# EAGLE design RF1_RS485v5 (EAGLE 6.4)
RS485/Renard adapter for the RF1
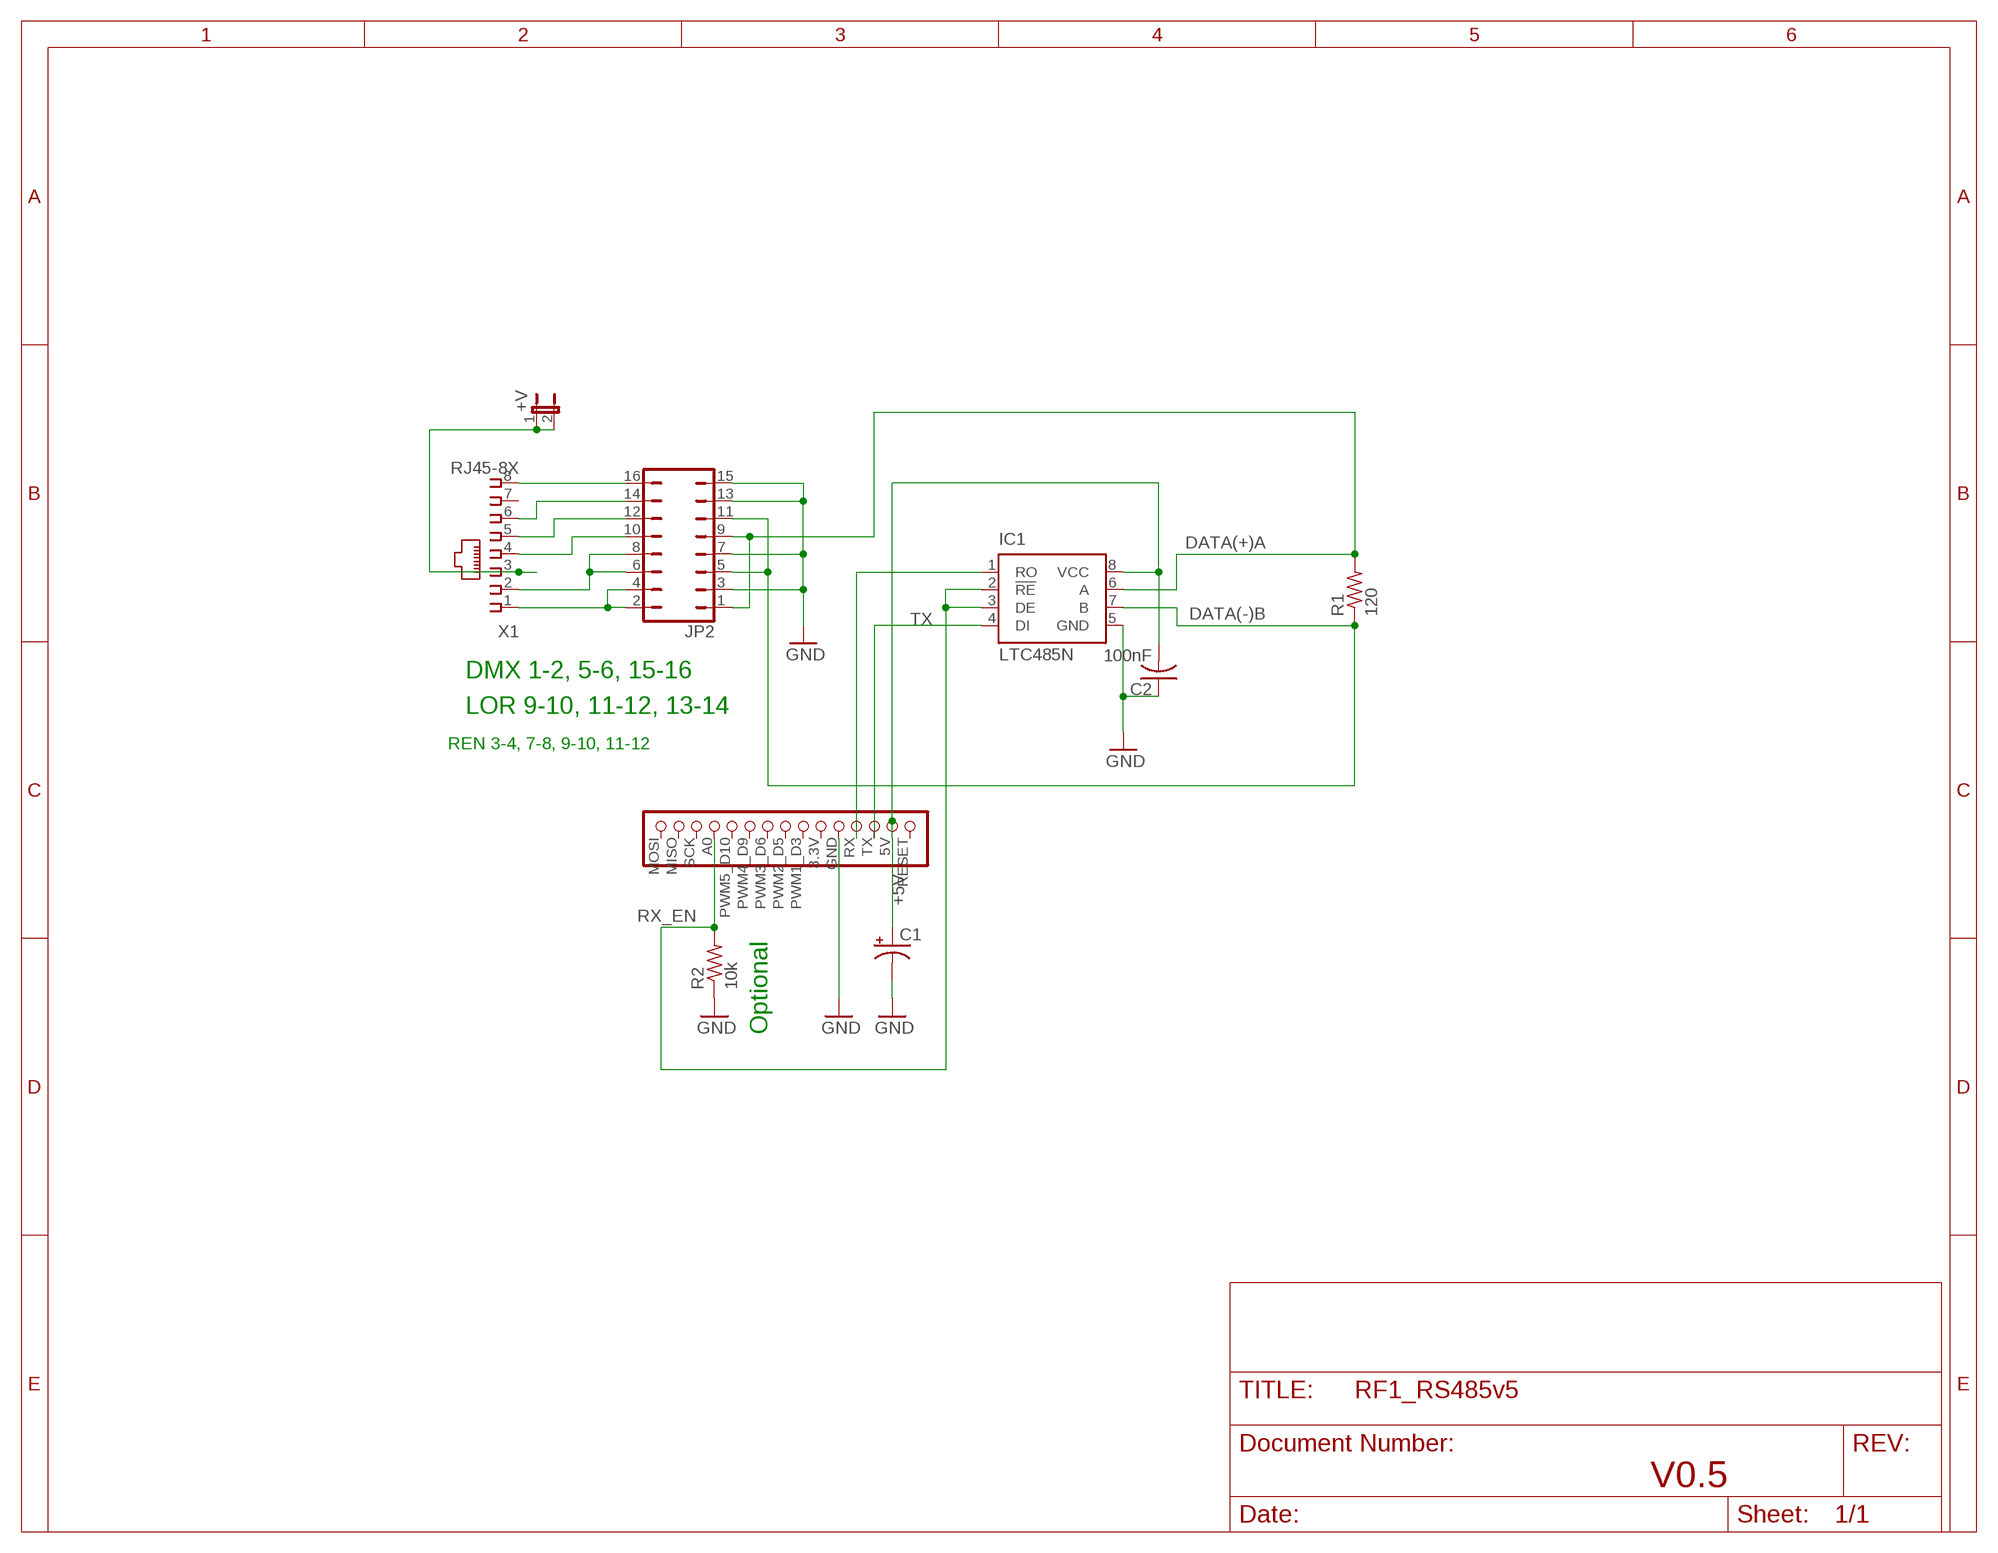
[diagram p0: schematic, sheet 1]

## Parts
+V  JP1E  [JP1]
C1  CPOL-USE5-5  [E5-5]
C2  100nF  C-US025-024X044  [C025-024X044]
IC1  LTC485N  [DIL08]
JP2  JP8Q  [JP8Q]
R1  120  R-US_FLIPFLOP  [0805-THM]
R2  10k  R-US_FLIPFLOP  [0805-THM]
U$1  RF1_HEADER_LEFT  [RF1_LEFTHEADER_ONLY]
X1  RJ45-8X  [RJ45-NO-SHIELD]

## Nets
+5V: C1.+ C2.2 IC1.8(VCC) U$1.5V
DATA(+)A: IC1.6(A) JP2.1 JP2.9 R1.2
DATA(-)B: IC1.7(B) JP2.5 JP2.11 R1.1
GND: C1.- C2.1 IC1.5(GND) JP2.3 JP2.7 JP2.13 JP2.15 R2.1 U$1.GND
N$1: JP2.2 JP2.4 X1.1
N$2: JP2.6 JP2.8 X1.2
N$3: JP2.16 X1.8
N$4: JP2.14 X1.6
N$5: JP2.12 X1.5
N$6: JP2.10 X1.4
N$7: +V.1 +V.2 X1.3
RX: IC1.1(RO) U$1.RX
RX_EN: IC1.2(!RE) IC1.3(DE) R2.2 U$1.A0(PC0)
TX: IC1.4(DI) U$1.TX
Unconnected: U$1.3.3V U$1.MISO U$1.MOSI U$1.PWM1_D3(PWM1) U$1.PWM2_D5(PWM2) U$1.PWM3_D6(PWM3) U$1.PWM4_D9(PWM4) U$1.PWM5_D10(PWM5) U$1.RESET U$1.SCK X1.7

## Notes on the sheet
- DMX 1-2, 5-6, 15-16
- LOR 9-10, 11-12, 13-14
- REN 3-4, 7-8, 9-10, 11-12
- Optional
- V0.5

## Library data of the parts
+V = jumper:JP1E: JUMPER
C1 = adafruit:CPOL-US: POLARIZED CAPACITOR, American symbol
C2 = adafruit:C-US: CAPACITOR, American symbol
IC1 = linear-technology:LTC485: Low Power RS485 Interface Transceiver Source: http://www.linear.com/pc/downloadDocument.do?navId=H0,C1,C1007,C1017,P2064,D1718; OC_FARNELL: unknown; OC_NEWARK: unknown
JP2 = jumper:JP8Q: JUMPER
R1 R2 = adafruit:R-US_: RESISTOR, American symbol
U$1 = komby1:RF1_HEADER_LEFT
X1 = con-tycoelectronics_komby:RJ45: CORCOM Modular RJ Jacks No Shield Source: www.tycoelectronics.com .. ENG_DS_1654001_1099_RJ_L_0507.pdf; MPN: RJ45-8X; OC_FARNELL: unknown; OC_NEWARK: 16R6101

## Board
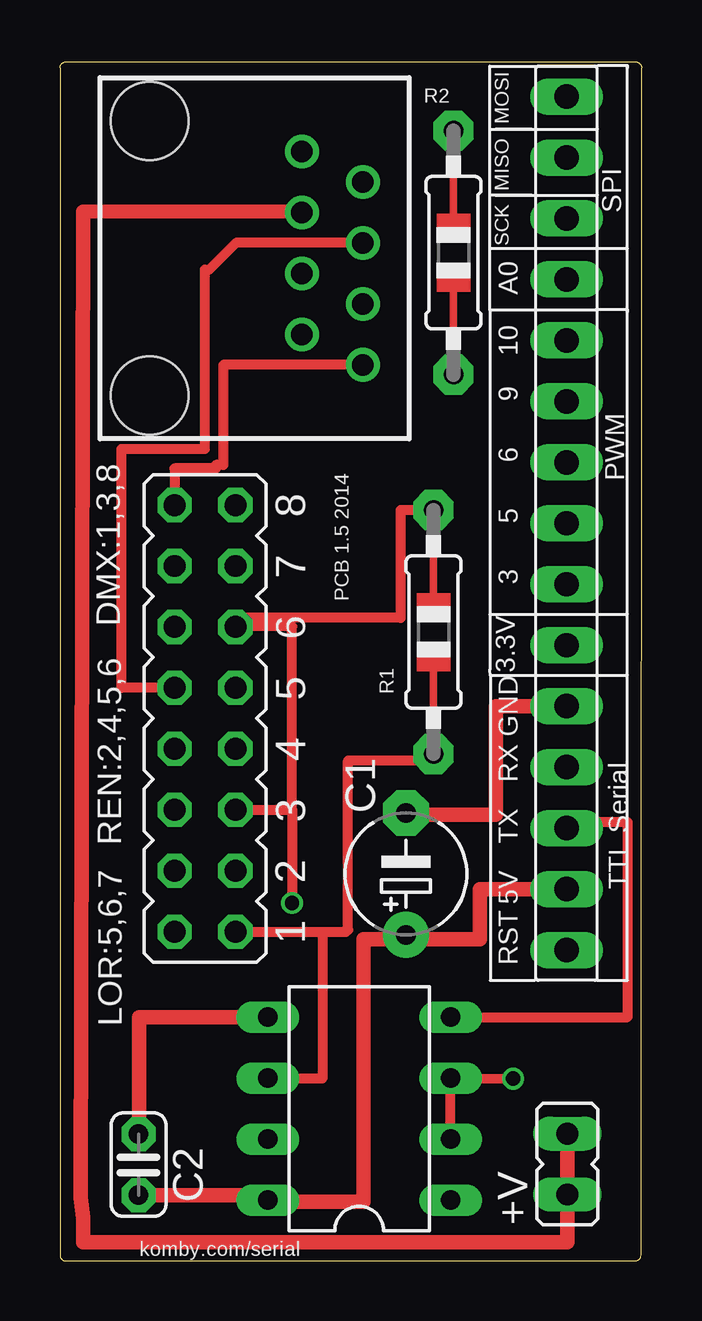
[diagram p1: board, top side]
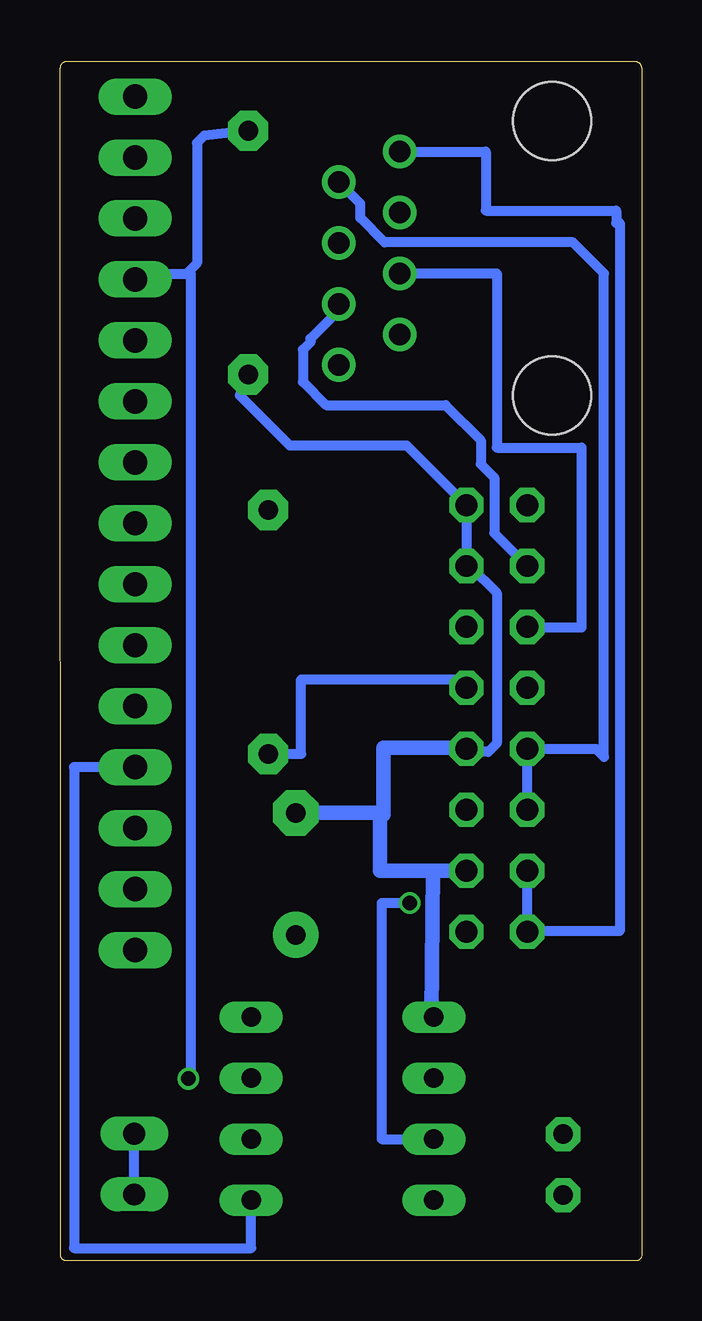
[diagram p2: board, bottom side, seen from below]

Size 24.26 x 49.96 mm. Coordinates in mm from the lower left corner, seen from the top.
Outline: 0,49.71 0,0.25 arc90 0.25,0 23.98,0 arc90 24.23,0.25 24.26,49.71 arc90 24,49.96 0.25,49.96 arc90 0,49.71
Copper layers (1*16): Top 0.035mm / dielectric 1.5mm / Bottom 0.035mm
Design rules "Fusion_eagle_rule_v1.1": minimum track width 6mil, minimum drill 12mil, track to track 6mil, track to pad 6mil, pad to pad 6mil, via to via 6mil, smd to smd 0mil, copper to edge 10mil, drill to drill 10mil, minimum pad ring 10mil, minimum via ring 6mil, stop-mask expansion 2mil, vias tented up to drill 100mil, thermal gap 10mil

### Footprints (pad centres in the part's own frame; a part is rotated, then mirrored left to right if it is on the bottom)
JP1 = drill 0.914 long: 1 0,-1.27; 2 0,1.27
E5-5 = drill 0.813 pad 1.905: + -2.54,0 | drill 0.813 pad 1.905 octagon: - 2.54,0
C025-024X044 = drill 0.813 pad 1.422 octagon: 1 -1.27,0; 2 1.27,0
DIL08 = drill 0.813 long: 1 -3.81,-3.81; 2 -1.27,-3.81; 3 1.27,-3.81; 4 3.81,-3.81; 5 3.81,3.81; 6 1.27,3.81; 7 -1.27,3.81; 8 -3.81,3.81
JP8Q = drill 0.914 octagon: 1 -8.89,-1.27; 2 -8.89,1.27; 3 -6.35,-1.27; 4 -6.35,1.27; 5 -3.81,-1.27; 6 -3.81,1.27; 7 -1.27,-1.27; 8 -1.27,1.27; 9 1.27,-1.27; 10 1.27,1.27; 11 3.81,-1.27; 12 3.81,1.27; 13 6.35,-1.27; 14 6.35,1.27; 15 8.89,-1.27; 16 8.89,1.27
0805-THM = drill 0.813 pad 1.676 octagon: 1 -5.08,0; 2 5.08,0
RF1_LEFTHEADER_ONLY = drill 1.016 long: 3.3V 1.42,-5.215; 5V 1.42,-15.375; A0 1.42,10.025; GND 1.42,-7.755; MISO 1.42,15.105; MOSI 1.42,17.645; PWM1_D3 1.42,-2.675; PWM2_D5 1.42,-0.135; PWM3_D6 1.42,2.405; PWM4_D9 1.42,4.945; PWM5_D10 1.42,7.485; RESET 1.42,-17.915; RX 1.42,-10.295; SCK 1.42,12.565; TX 1.42,-12.835
RJ45-NO-SHIELD = drill 0.9 pad 1.4: 1 -4.445,6.35; 2 -3.175,8.89; 3 -1.905,6.35; 4 -0.635,8.89; 5 0.635,6.35; 6 1.905,8.89; 7 3.175,6.35; 8 4.445,8.89 | hole 3.251: -5.715,0; 5.715,0

### Placement (x,y rotation side)
+V  21.16,4.04 0 top
C1  14.43,16.13 90 top
C2  3.28,4.01 270 top
IC1  12.48,6.35 90 top
JP2  6.05,22.61 90 top
R1  15.58,26.21 270 top
R2  16.41,42.01 90 top
U$1  19.7,30.87 0 top
X1  3.74,41.78 270 top

### Tracks (layer width: path | path; a pad name or v marks a point on that pad's centre or on a via)
+5V
  Top 0.406: 8.66,2.74 IC1.8 8.66,2.46
  Top 0.61: U$1.5V 17.5,15.49 17.5,13.41 14.3,13.41 | 14.3,13.41 C1.+ | C2.2 8.66,2.74 | 14.3,13.41 12.65,13.41 12.65,2.46 8.66,2.46
DATA(+)A
  Top 0.406: R1.2 15.58,20.85 12.01,20.85 12.01,13.79 11.91,13.79 11.91,13.72 JP2.1 10.95,13.72 10.95,7.59 8.66,7.59 IC1.6
  Bottom 0.406: R1.2 14.2,21.13 14.2,24.23 7.32,24.23 JP2.9
DATA(-)B  (via drill 0.6)
  Top 0.406: JP2.5 9.68,18.8 | 9.68,18.8 9.68,26.44 7.32,26.44 JP2.11 7.32,26.8 14.2,26.8 14.2,31.29 R1.1 | 9.68,18.8 v9.68,14.91
  Bottom 0.406: v9.68,14.91 10.85,14.91 10.85,5.08 IC1.7
GND
  Top 0.406: C2.1 3.3,5.28 | IC1.5
  Top 0.61: U$1.GND 18.19,23.11 18.19,18.59 14.5,18.59 C1.- | 3.3,5.28 3.3,10.16 IC1.5
  Bottom 0.406: 10.92,18.59 10.77,18.59 | 7.32,21.39 JP2.7 7.19,21.21 6.4,21.21 6.04,21.57 6.04,27.84 7.16,28.96 JP2.13 | JP2.3 8.71,16.26 | 8.76,10.26 8.62,10.41 IC1.5 | R2.1 16.76,36.07 14.68,33.98 9.8,33.98 JP2.15 JP2.13 | 7.67,28.6 JP2.13
  Bottom 0.61: 10.77,18.59 10.77,21.39 7.32,21.39 | JP2.3 10.92,16.26 10.92,18.59 11,18.67 C1.- | 8.71,16.26 8.76,10.26
N$1
  Bottom 0.406: JP2.4 JP2.2 4.78,13.74 0.91,13.74 0.91,43.26 1.07,43.26 1.07,43.76 6.5,43.76 6.5,46.23 X1.1
N$2
  Bottom 0.406: JP2.6 JP2.8 1.91,21.34 1.57,21.01 1.57,41.15 2.87,42.44 10.72,42.44 11.73,43.46 11.73,44.06 X1.2
N$3
  Top 0.406: X1.8 6.81,37.34 6.81,33.17 6.5,33.17 6.5,33.02 4.78,33.02 JP2.16
N$4
  Bottom 0.406: X1.6 12.63,39.62 13.82,38.43 13.82,38.28 14.12,37.97 14.12,36.63 13.16,35.66 8.18,35.66 6.71,34.19 6.71,33.2 6.15,32.64 6.15,30.33 JP2.14
N$5
  Bottom 0.406: X1.5 6.04,41.15 6.04,33.88 2.52,33.88 2.52,26.39 4.78,26.39 JP2.12
N$6
  Top 0.406: JP2.10 2.56,23.88 2.56,33.83 6.04,33.83 6.04,41.3 6.22,41.3 7.37,42.44 12.6,42.44 X1.4
N$7
  Top 0.61: +V.2 21.16,0.79 0.96,0.79 0.96,1.8 0.86,2.64 0.96,43.71 10.09,43.74 X1.3
  Bottom 0.406: +V.1 +V.2
RX
  Bottom 0.406: U$1.RX 23.67,20.57 23.67,0.53 16.29,0.53 IC1.1
RX_EN  (via drill 0.6)
  Top 0.406: IC1.2 IC1.3 16.43,7.62 v18.9,7.59
  Bottom 0.406: v18.9,7.59 18.8,7.85 18.8,41.12 19,41.12 | 19,41.12 21.12,41.12 U$1.A0 | R2.2 18.24,46.89 18.54,46.58 18.54,41.58 19,41.12
TX
  Top 0.406: IC1.4 23.67,10.16 23.67,18.29 21.12,18.29 U$1.TX

### Text on the board
tNames: PCB 1.5 2014 | DMX:1,3,8 | REN:2,4,5,6 | LOR:5,6,7 | komby.com/serial